# Altium schematic sheet envelope.SchDoc
size A
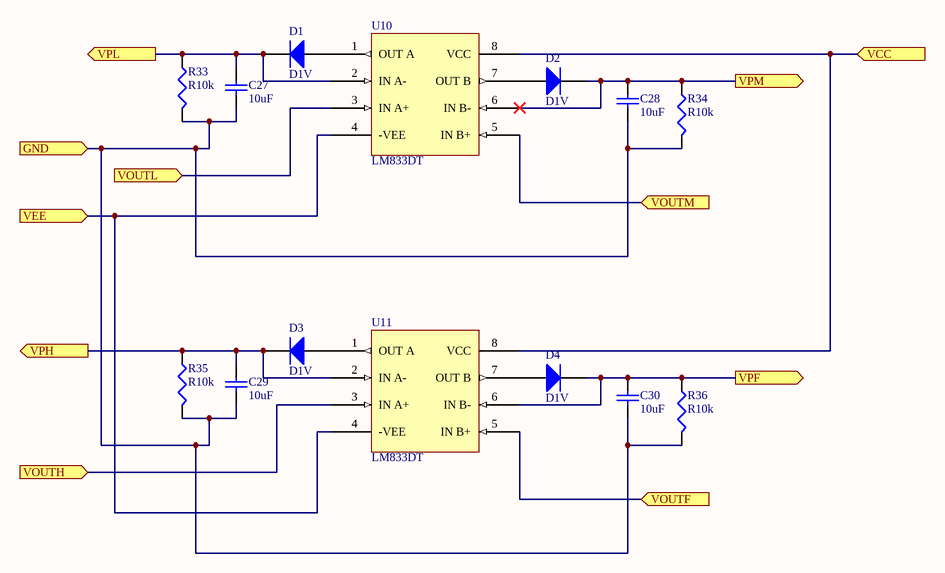
[diagram p0: envelope.SchDoc]

## Parts
C27  10uF  [C0603]
C28  10uF  [C0603]
C29  10uF  [C0603]
C30  10uF  [C0603]
D1  D1V  [D1206]
D2  D1V  [D1206]
D3  D1V  [D1206]
D4  D1V  [D1206]
R33  R10k  [R0603]
R34  R10k  [R0603]
R35  R10k  [R0603]
R36  R10k  [R0603]
U10  LM833DT  [soic8]
U11  LM833DT  [soic8]

## Ports
GND (in), VCC (in), VEE (in), VOUTF (in), VOUTH (in), VOUTL (in), VOUTM (in), VPF (out), VPH (out), VPL (out), VPM (out)

## Nets
GND: C27.2 C28.2 C29.2 C30.2 R33.2 R34.2 R35.2 R36.2 ; port GND
VCC: U10.8(VCC) U11.8(VCC) ; port VCC
VEE: U10.4(-VEE) U11.4(-VEE) ; port VEE
VOUTF: U11.5(IN_B+) ; port VOUTF
VOUTH: U11.3(IN_A+) ; port VOUTH
VOUTL: U10.3(IN_A+) ; port VOUTL
VOUTM: U10.5(IN_B+) ; port VOUTM
VPF: C30.1 D4.2(K) R36.1 U11.6(IN_B-) ; port VPF
VPH: C29.1 D3.2(K) R35.1 U11.2(IN_A-) ; port VPH
VPL: C27.1 D1.2(K) R33.1 U10.2(IN_A-) ; port VPL
VPM: C28.1 D2.2(K) R34.1 U10.6(IN_B-) ; port VPM
NetD1_1: D1.1(A) U10.1(OUT_A)
NetD2_1: D2.1(A) U10.7(OUT_B)
NetD3_1: D3.1(A) U11.1(OUT_A)
NetD4_1: D4.1(A) U11.7(OUT_B)

## Library data of the parts
C27-C30 = C10uF: 10 uF Surface Mount Capacitor; Manufacturer: Yageo; Manufacturer Part Number: CC0603KRX5R5BB106; Capacitance: 10µF; Tolerance: ±10%; Voltage - Rated: 6.3V; Temperature Coefficient: X5R; Supplier 1: Digi-Key; RoHS: RoHS Compliant; Category: Capacitors; Stock 1: 18386; Pricing 1: 1=0.27, 10=0.186, 25=0.1488, 50=0.124, 100=0.1054, 250=0.08368, 500=0.0744, 1000=0.06509 (USD); Packaging: Digi-Reel®; Part Status: Active; Operating Temperature: -55°C ~ 85°C; Features: -; Ratings: -; Applications: General Purpose; Mounting Type: Surface Mount, MLCC; Package / Case: 0603 (1608 Metric); Size / Dimension: 0.063" L x 0.031" W (1.60mm x 0.80mm); Height - Seated (Max): -; Thickness (Max): 0.035" (0.90mm); Lead Spacing: -; Lead Style: -; ComponentLink1URL: http://www.yageo.com/documents/recent/UPY-GPHC_X5R_4V-to-50V_23.pdf; ComponentLink1Description: http://www.yageo.com/documents/recent/UPY-GPHC_X5R_4V-to-50V_23.pdf; Failure Rate: -; Supplier Part Number 1: 311-1781-6-ND
D1-D4 = D1V: Standard 1V Diode; Manufacturer: Bourns Inc.; Manufacturer Part Number: CD1206-S01575; Voltage - DC Reverse (Vr) (Max): 100V; Current - Average Rectified (Io): 150mA; Voltage - Forward (Vf) (Max) @ If: 1V @ 50mA; Speed: Small Signal =< 200mA (Io), Any Speed; Reverse Recovery Time (trr): 4ns; Current - Reverse Leakage @ Vr: 2.5µA @ 100V; Capacitance @ Vr, F: 3pF @ 0V, 100MHz; Supplier 1: Digi-Key; RoHS: RoHS Compliant; Category: Discrete Semiconductor Products; Stock 1: 122779; Pricing 1: 1=0.15, 10=0.142, 25=0.1288, 100=0.0927, 250=0.0546, 500=0.04532, 1000=0.0309, 2500=0.02626 (USD); Packaging: Cut Tape (CT); Part Status: Active; Diode Type: Standard; Mounting Type: Surface Mount; Package / Case: 1206 (3216 Metric); Supplier Device Package: 1206; Operating Temperature - Junction: -55°C ~ 125°C; ComponentLink1URL: http://www.bourns.com/docs/Product-Datasheets/CD1206_S01575.pdf; ComponentLink1Description: http://www.bourns.com/docs/Product-Datasheets/CD1206_S01575.pdf; Supplier Part Number 1: CD1206-S01575CT-ND
R33-R36 = R10k: 10k Ohms Surface Mount Resistor; Manufacturer: Yageo; Manufacturer Part Number: RC0603FR-0710KL; Tolerance: ±1%; Power (Watts): 0.1W, 1/10W; Temperature Coefficient: ±100ppm/°C; Supplier 1: Digi-Key; RoHS: RoHS Compliant; Category: Resistors; Stock 1: 15519632; Pricing 1: 1=0.1, 10=0.013, 25=0.0092, 50=0.007, 100=0.0052, 250=0.00396, 500=0.00316, 1000=0.00233 (USD); Packaging: Digi-Reel®; Part Status: Active; Resistance (Ohms): 10k; Composition: Thick Film; Features: Moisture Resistant; Operating Temperature: -55°C ~ 155°C; Package / Case: 0603 (1608 Metric); Supplier Device Package: 0603; Size / Dimension: 0.063" L x 0.031" W (1.60mm x 0.80mm); Height - Seated (Max): 0.022" (0.55mm); Number of Terminations: 2; Failure Rate: -; ComponentLink1URL: http://www.yageo.com/NewPortal/yageodocoutput?fileName=/pdf/R-Chip/PYu-RC_Group_51_RoHS_L_4.pdf; ComponentLink1Description: http://www.yageo.com/NewPortal/yageodocoutput?fileName=/pdf/R-Chip/PYu-RC_Group_51_RoHS_L_4.pdf; Supplier Part Number 1: 311-10.0KHRDKR-ND
U10 U11 = LM833DT: IC Dual Audio Amplifier; Manufacturer: STMicroelectronics; Number of Circuits: 2; Slew Rate: 7 V/µs; Gain Bandwidth Product: 15MHz; Current - Input Bias: 300nA; Voltage - Input Offset: 300µV; Current - Supply: 4mA; Voltage - Supply, Single/Dual (±): 5 V ~ 30 V, ±2.5 V ~ 15 V; Supplier 1: Digi-Key; Manufacturer Part Number: LM833DT; RoHS: RoHS Compliant; Category: Integrated Circuits (ICs); Stock 1: 35363; Pricing 1: 1=0.45, 10=0.382, 100=0.2855, 500=0.22434, 1000=0.17335 (USD); Packaging: Cut Tape (CT); Part Status: Active; Amplifier Type: Audio; Output Type: -; -3db Bandwidth: -; Current - Output / Channel: -; Operating Temperature: -40°C ~ 105°C; Mounting Type: Surface Mount; Package / Case: 8-SOIC (0.154", 3.90mm Width); Supplier Device Package: 8-SO; ComponentLink1URL: http://www.st.com/content/ccc/resource/technical/document/datasheet/3b/52/12/a5/70/7c/44/0a/CD00000470.pdf/files/CD00000470.pdf/jcr:content/translations/en.CD00000470.pdf; ComponentLink1Description: http://www.st.com/content/ccc/resource/technical/document/datasheet/3b/52/12/a5/70/7c/44/0a/CD00000470.pdf/files/CD00000470.pdf/jcr:content/translations/en.CD00000470.pdf; Supplier Part Number 1: 497-1597-1-ND